# Altium schematic sheet IMU.SchDoc
size A; SheetNumber: 5; SheetTotal: 10
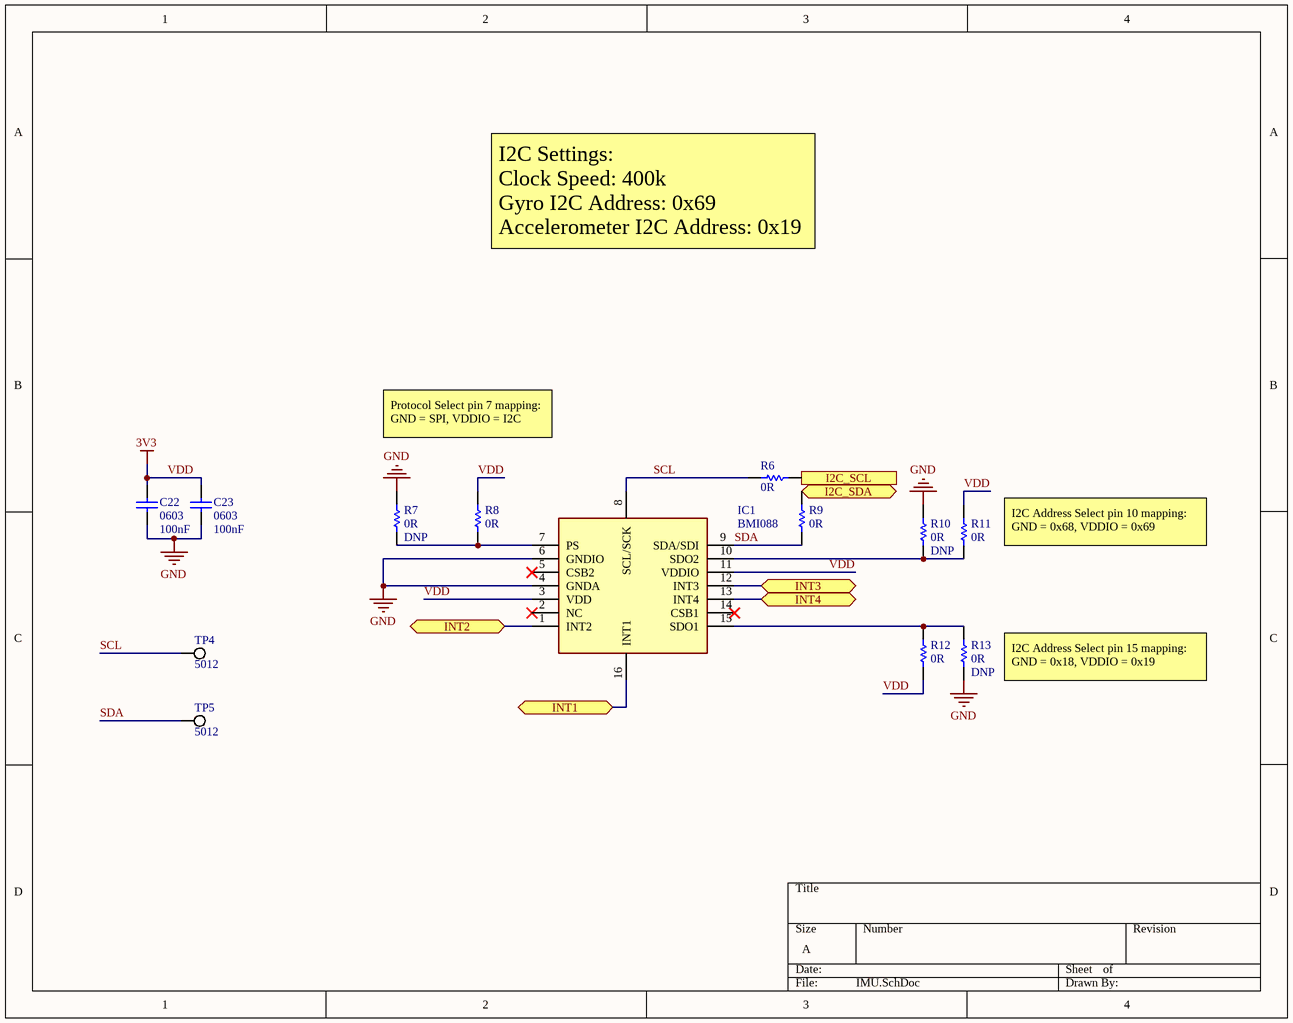
[diagram p0: IMU.SchDoc]

## Parts
C22  Case Code (Imperial): 0603  Capacitance: 100nF  [CAPC1608X87X35NL15T15]  (hidden comment: C0603X104K5RACTU)
C23  Case Code (Imperial): 0603  Capacitance: 100nF  [CAPC1608X87X35NL15T15]  (hidden comment: C0603X104K5RACTU)
IC1  BMI088  [BMI088]
R6  Resistance: 0R  [RESC2013X60X35LL10T20]  (hidden comment: RC0805JR-100RL)
R7  Resistance: 0R  [RESC2013X60X35LL10T20]  (hidden comment: RC0805JR-100RL)
R8  Resistance: 0R  [RESC2013X60X35LL10T20]  (hidden comment: RC0805JR-100RL)
R9  Resistance: 0R  [RESC2013X60X35LL10T20]  (hidden comment: RC0805JR-100RL)
R10  Resistance: 0R  [RESC2013X60X35LL10T20]  (hidden comment: RC0805JR-100RL)
R11  Resistance: 0R  [RESC2013X60X35LL10T20]  (hidden comment: RC0805JR-100RL)
R12  Resistance: 0R  [RESC2013X60X35LL10T20]  (hidden comment: RC0805JR-100RL)
R13  Resistance: 0R  [RESC2013X60X35LL10T20]  (hidden comment: RC0805JR-100RL)
TP4  5012  [KSTN-5012_V]
TP5  5012  [KSTN-5012_V]

## Ports
I2C_SCL (in, see TCU[2A], MainConnector[2C]), I2C_SDA (bidir, see TCU[2A], MainConnector[3B]), INT1 (bidir, see TCU[2A]), INT2 (bidir, see TCU[2A]), INT3 (bidir, see TCU[2A]), INT4 (bidir, see TCU[2A])

## Nets
GND: C22.2 C23.2 IC1.4(GNDA) IC1.6(GNDIO) R7.2 R10.2 R13.1
VDD: C22.1 C23.1 IC1.3(VDD) IC1.11(VDDIO) R8.2 R11.2 R12.1  [also labelled 3V3]
I2C_SCL: R6.1 ; port I2C_SCL
I2C_SDA: R9.2 ; port I2C_SDA
INT1: IC1.16(INT1) ; port INT1
INT2: IC1.1(INT2) ; port INT2
INT3: IC1.12(INT3) ; port INT3
INT4: IC1.13(INT4) ; port INT4
SCL: IC1.8(SCL/SCK) R6.2 TP4.1
SDA: IC1.9(SDA/SDI) R9.1 TP5.1
NetIC1_7: IC1.7(PS) R7.1 R8.1
NetIC1_10: IC1.10(SDO2) R10.1 R11.1
NetIC1_15: IC1.15(SDO1) R12.2 R13.2

Not connected (* = marked no-connect by the designer): IC1 2(NC)* 5(CSB2)* 14(CSB1)*

## Notes on the sheet
- I2C Settings:
  Clock Speed: 400k
  Gyro I2C Address: 0x69
  Accelerometer I2C Address: 0x19
- Protocol Select pin 7 mapping:
  GND = SPI, VDDIO = I2C
- (near R11) I2C Address Select pin 10 mapping:
  GND = 0x68, VDDIO = 0x69
- (near R13) I2C Address Select pin 15 mapping:
  GND = 0x18, VDDIO = 0x19

## Library data of the parts
C22 C23 = CMP-2006-03300-1: Manufacturer: Kemet; Dielectric Material: Ceramic; Tolerance: 10%; Voltage Rating: 50V; Dielectric: X7R; Dissipation Factor: 2.5%; Part Number: C0603X104K5RACTU; Supplier 1: Digi-Key; Supplier Part Number 1: 399-7969-1-ND; Manufacturer Part Number: C0603X104K5RACTU; Stock 1: 2206541; Pricing 1: 1 = 0.21000, 10 = 0.14500, 100 = 0.07340, 500 = 0.05024, 1000 = 0.04444 (USD); RoHS: Yes; Mount: Surface Mount; Case/Package: 0603; Number of Pins: 2; Case Code (Metric): 1608; Min Operating Temperature: -55°C; Max Operating Temperature: 125°C; Packaging: Tape and Reel; Package Quantity: 1; Voltage Rating (DC): 50V; Termination: SMD/SMT; Voltage: 50V; Features: Soft Termination; Length: 1.6mm; Height: 0.8mm; Width: 0.8mm; Depth: 0.8mm; Thickness: 0.034inch; Radiation Hardening: No; REACH SVHC: No SVHC; ComponentLink1URL: https://datasheet.ciiva.com/7823/1776088-7823908.pdf?src-supplier=Element14; ComponentLink1Description: https://datasheet.ciiva.com/7823/1776088-7823908.pdf?src-supplier=Element14; ComponentLink2URL: https://datasheet.ciiva.com/26948/getdatasheetpartid-385607-26948458.pdf?src-supplier=Verical; ComponentLink2Description: https://datasheet.ciiva.com/26948/getdatasheetpartid-385607-26948458.pdf?src-supplier=Verical; ComponentLink3URL: https://datasheet.ciiva.com/7823/1776088-7823909.pdf?src-supplier=Element14; ComponentLink3Description: https://datasheet.ciiva.com/7823/1776088-7823909.pdf?src-supplier=Element14; ComponentLink4URL: https://datasheet.ciiva.com/6279/kem-c1013-x7r-ft-cap-smd-6279993.pdf?src-supplier=Digi-Key; ComponentLink4Description: https://datasheet.ciiva.com/6279/kem-c1013-x7r-ft-cap-smd-6279993.pdf?src-supplier=Digi-Key; ComponentLink5URL: https://datasheet.ciiva.com/28533/1918693-28533212.pdf?src-supplier=Element14; ComponentLink5Description: https://datasheet.ciiva.com/28533/1918693-28533212.pdf?src-supplier=Element14; ComponentLink6URL: https://datasheet.ciiva.com/6279/kem-c1013-x7r-ft-cap-smd-6279999.pdf?src-supplier=Digi-Key; ComponentLink6Description: https://datasheet.ciiva.com/6279/kem-c1013-x7r-ft-cap-smd-6279999.pdf?src-supplier=Digi-Key; ComponentLink7URL: https://datasheet.ciiva.com/6279/kem-c1013-x7r-ft-cap-smd-6279990.pdf?src-supplier=Digi-Key; ComponentLink7Description: https://datasheet.ciiva.com/6279/kem-c1013-x7r-ft-cap-smd-6279990.pdf?src-supplier=Digi-Key; ComponentLink8URL: https://datasheet.ciiva.com/14597/70096394-14597743.pdf?src-supplier=Allied+Electronics; ComponentLink8Description: https://datasheet.ciiva.com/14597/70096394-14597743.pdf?src-supplier=Allied+Electronics
IC1 = BMI088: Integrated Circuit; Manufacturer_Name: BOSCH; Datasheet Link: https://datasheet.datasheetarchive.com/originals/distributors/Datasheets_SAMA/994c3bf88e91a9e9fead6a819d348e4d.pdf; Height: 1.45mm; Manufacturer_Part_Number: BMI088; Mouser Part Number: 262-BMI088; Mouser Price/Stock: https://www.mouser.co.uk/ProductDetail/Bosch-Sensortec/BMI088?qs=f9yNj16SXrIMFspTV6RB6Q%3D%3D; Arrow Part Number: BMI088; Arrow Price/Stock: https://www.arrow.com/en/products/bmi088/bosch?region=europe; Supplier 1: Arrow Electronics; Supplier Part Number 1: BMI088
R6-R13 = CMP-2000-06963-1: Chip Resistor, 0 Ohm, +/- 5%, 125 mW, -55 to 155 degC, 0805 (2012 Metric), RoHS, Tape and Reel; Manufacturer: Yageo; Product Length (mm): 2mm; Tolerance (+ or -): NotRequired; Case Style: Molded; Product Height (mm): 0.5mm; Power Rating(s): NotRequiredW; Product Depth (mm): 1.25mm; Mounting Technology: SurfaceMount; Military Standard: NotRequired; Operating Temp Range: -55Cto155C; Temperature Coefficient: NotRequired; Package Description: 2-Pin Surface Mounted Device, Body 2 x 1.25 mm; Datasheet Version: Rev. 7, 05/2017; Failure Rate: NotRequired; Manufacturer URL: http://www.yageo.com/; Datasheet URL: http://www.yageo.com/documents/recent/PYu-RC_Group_51_RoHS_L_7.pdf; Packaging: TapeandReel; Package Reference: 0805; Package / Case: 0805; Termination Style: NotRequired; Type: ThickFilm; Construction: Rectangular
  R7 R10 R13: DNP: DNP
TP4 TP5 = CMP-1672-00004-4: Test Point, White, Through Hole, RoHS, Bulk; Manufacturer: Keystone; DatasheetVersion: Rev. F, 12/2013; ComponentLink1URL: http://www.keyelco.com/; PackageReference: 5012; RoHSCompliant: true; ComponentLink2Description: Datasheet; Colour: White; Contact Material: Bronze; PackageDescription: 1-Pin Through Hole Device, Dia 3.17 mm; Mounting Technology: Through Hole; Mount: Through Hole; Package Quantity: 100; ComponentLink1Description: Manufacturer URL; Pins: 1; Height: 8.12 mm; Packaging: Bulk; REACH SVHC: No SVHC; Contact Plating: Silver; Length: 11.3 mm; ComponentLink2URL: http://www.keyelco.com/product-pdf.cfm?p=1321